# Altium project basketball_robot_main_board_2018.PrjPcb
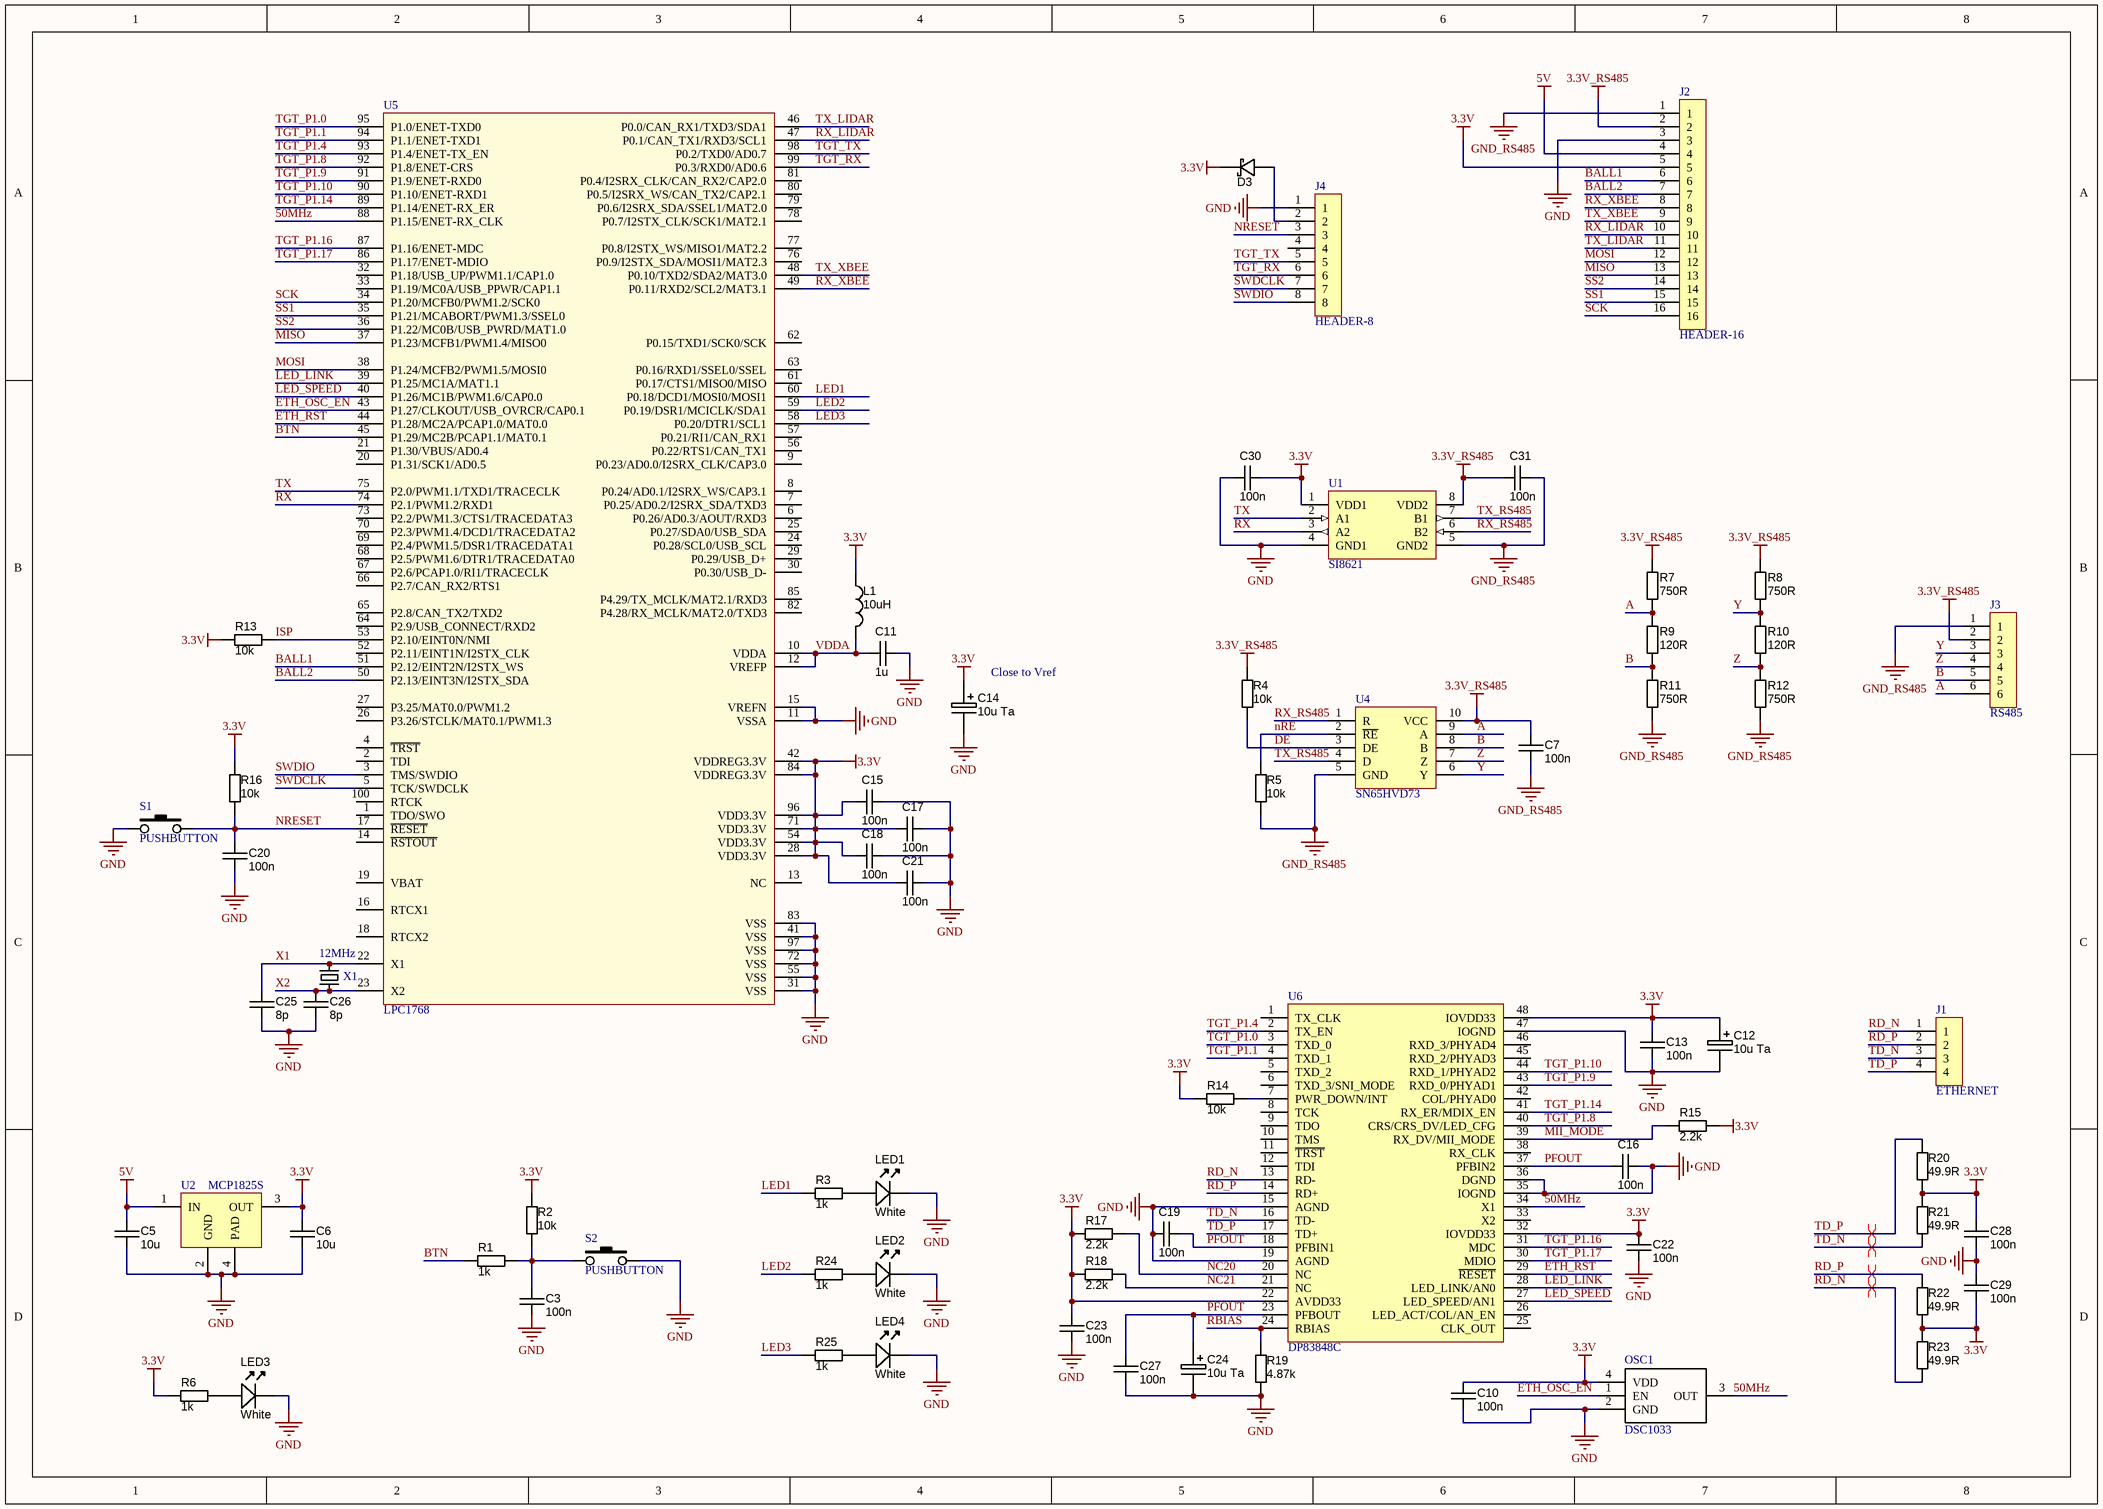
[diagram p0: basketball_robot_main_board_2018.SchDoc]
1 sheet, 70 parts. Net scope: global (net labels, ports and power ports of the same name join across sheets).
Board file: basketball_robot_main_board_2018.PcbDoc

## Sheet basketball_robot_main_board_2018.SchDoc
size A3

### Parts
C3  100n  [CAPC1608X90N]
C5  10u  [CAPC3216X180N]
C6  10u  [CAPC3216X180N]
C7  100n  [CAPC1608X90N]
C10  100n  [CAPC1608X90N]
C11  1u  [CAPC1608X90N]
C12  10u Ta  [CAPMP3528X210N]
C13  100n  [CAPC1608X90N]
C14  10u Ta  [CAPMP3528X210N]
C15  100n  [CAPC1608X90N]
C16  100n  [CAPC1608X90N]
C17  100n  [CAPC1608X90N]
C18  100n  [CAPC1608X90N]
C19  100n  [CAPC1608X90N]
C20  100n  [CAPC1608X90N]
C21  100n  [CAPC1608X90N]
C22  100n  [CAPC1608X90N]
C23  100n  [CAPC1608X90N]
C24  10u Ta  [CAPMP3528X210N]
C25  8p  [CAPC1608X90N]
C26  8p  [CAPC1608X90N]
C27  100n  [CAPC1608X90N]
C28  100n  [CAPC1608X90N]
C29  100n  [CAPC1608X90N]
C30  100n  [CAPC1608X90N]
C31  100n  [CAPC1608X90N]
D3  (no value)  [SOD323]
J1  ETHERNET  [MICRO-MATCH-FOB-04]
J2  HEADER-16  [MICRO-MATCH-FOB-SMD-16]
J3  RS485  [MICRO-MATCH-FOB-06]
J4  HEADER-8  [MICRO-MATCH-FOB-SMD-08]
L1  10uH  [INDC1608N]
LED1  White  [LED-0603-WHITE]
LED2  White  [LED-0603-WHITE]
LED3  White  [LED-0603-WHITE]
LED4  White  [LED-0603-WHITE]
OSC1  DSC1033  [DSC1033-3.2x2.5]
R1  1k  [RESC1608X55N]
R2  10k  [RESC1608X55N]
R3  1k  [RESC1608X55N]
R4  10k  [RESC1608X55N]
R5  10k  [RESC1608X55N]
R6  1k  [RESC1608X55N]
R7  750R  [RESC1608X55N]
R8  750R  [RESC1608X55N]
R9  120R  [RESC1608X55N]
R10  120R  [RESC1608X55N]
R11  750R  [RESC1608X55N]
R12  750R  [RESC1608X55N]
R13  10k  [RESC1608X55N]
R14  10k  [RESC1608X55N]
R15  2.2k  [RESC1608X55N]
R16  10k  [RESC1608X55N]
R17  2.2k  [RESC1608X55N]
R18  2.2k  [RESC1608X55N]
R19  4.87k  [RESC1608X55N]
R20  49.9R  [RESC1608X55N]
R21  49.9R  [RESC1608X55N]
R22  49.9R  [RESC1608X55N]
R23  49.9R  [RESC1608X55N]
R24  1k  [RESC1608X55N]
R25  1k  [RESC1608X55N]
S1  PUSHBUTTON  [KMR421NGLFS]
S2  PUSHBUTTON  [NKK_AB11AP-FA]
U1  SI8621  [SOIC8]
U2  MCP1825S  [SOT230P700X180-4N]
U4  SN65HVD73  [SOP10]
U5  LPC1768  [LQFP100]
U6  DP83848C  [PQFP48]
X1  12MHz  [XTAL-3.2x2.5]

### Nets
3.3V: C6.1 C10.2 C12.1 C13.2 C14.1 C15.1 C17.1 C18.1 C21.1 C22.2 C23.2 C28.2 C29.1 C30.1 D3.K J2.5 L1.1 OSC1.4(VDD) R2.2 R6.2 R13.2 R14.2 R15.1 R16.1 R17.2 R18.2 R20.2 R21.1 R22.2 R23.1 U1.1(VDD1) U2.3(OUT) U5.28(VDD3.3V) U5.42(VDDREG3.3V) U5.54(VDD3.3V) U5.71(VDD3.3V) U5.84(VDDREG3.3V) U5.96(VDD3.3V) U6.22(AVDD33) U6.32(IOVDD33) U6.48(IOVDD33)
3.3V_RS485: C7.1 C31.2 J2.2 J3.2 R4.2 R7.1 R8.1 U1.8(VDD2) U4.10(VCC)
5V: C5.1 J2.4 U2.1(IN)
GND: C3.2 C5.2 C6.2 C10.1 C11.2 C12.2 C13.1 C14.2 C15.2 C16.2 C17.2 C18.2 C19.1 C20.2 C21.2 C22.1 C23.1 C24.2 C25.2 C26.2 C27.1 C28.1 C29.2 C30.2 J2.3 J4.1 LED1.K LED2.K LED3.K LED4.K OSC1.2(GND) R19.2 S1.1 S2.2 U1.4(GND1) U2.2(GND) U2.4(PAD) U5.11(VSSA) U5.15(VREFN) U5.31(VSS) U5.41(VSS) U5.55(VSS) U5.72(VSS) U5.83(VSS) U5.97(VSS) U6.15(AGND) U6.19(AGND) U6.35(IOGND) U6.36(DGND) U6.47(IOGND)
GND_RS485: C7.2 C31.1 J2.1 J3.1 R5.1 R11.2 R12.2 U1.5(GND2) U4.5(GND)
50MHz: OSC1.3(OUT) U5.88(P1.15/ENET-RX_CLK) U6.34(X1)
A: J3.6 R7.2 R9.1 U4.9(A)
B: J3.5 R9.2 R11.1 U4.8(B)
BALL1: J2.6 U5.51(P2.12/EINT2N/I2STX_WS)
BALL2: J2.7 U5.50(P2.13/EINT3N/I2STX_SDA)
BTN: R1.2 U5.45(P1.29/MC2B/PCAP1.1/MAT0.1)
DE: R4.1 U4.3(DE)
ETH_OSC_EN: OSC1.1(EN) U5.43(P1.27/CLKOUT/USB_OVRCR/CAP0.1)
ETH_RST: U5.44(P1.28/MC2A/PCAP1.0/MAT0.0) U6.29(~{RESET})
ISP: R13.1 U5.53(P2.10/EINT0N/NMI)
LED1: R3.2 U5.60(P0.18/DCD1/MOSI0/MOSI1)
LED2: R24.2 U5.59(P0.19/DSR1/MCICLK/SDA1)
LED3: R25.2 U5.58(P0.20/DTR1/SCL1)
LED_LINK: U5.39(P1.25/MC1A/MAT1.1) U6.28(LED_LINK/AN0)
LED_SPEED: U5.40(P1.26/MC1B/PWM1.6/CAP0.0) U6.27(LED_SPEED/AN1)
MII_MODE: R15.2 U6.39(RX_DV/MII_MODE)
MISO: J2.13 U5.37(P1.23/MCFB1/PWM1.4/MISO0)
MOSI: J2.12 U5.38(P1.24/MCFB2/PWM1.5/MOSI0)
NC20: R17.1 U6.20(NC)
NC21: R18.1 U6.21(NC)
nRE: R5.2 U4.2(~{RE})
NRESET: C20.1 J4.3 R16.2 S1.2 U5.17(~{RESET})
PFOUT: C16.1 C19.2 C24.1 C27.2 U6.18(PFBIN1) U6.23(PFBOUT) U6.37(PFBIN2)
RBIAS: R19.1 U6.24(RBIAS)
RD_N: J1.1 R23.2 U6.13(RD-)
RD_P: J1.2 R22.1 U6.14(RD+)
RX: U1.3(A2) U5.74(P2.1/PWM1.2/RXD1)
RX_LIDAR: J2.10 U5.47(P0.1/CAN_TX1/RXD3/SCL1)
RX_RS485: U1.6(B2) U4.1(R)
RX_XBEE: J2.8 U5.49(P0.11/RXD2/SCL2/MAT3.1)
SCK: J2.16 U5.34(P1.20/MCFB0/PWM1.2/SCK0)
SS1: J2.15 U5.35(P1.21/MCABORT/PWM1.3/SSEL0)
SS2: J2.14 U5.36(P1.22/MC0B/USB_PWRD/MAT1.0)
SWDCLK: J4.7 U5.5(TCK/SWDCLK)
SWDIO: J4.8 U5.3(TMS/SWDIO)
TD_N: J1.3 R21.2 U6.16(TD-)
TD_P: J1.4 R20.1 U6.17(TD+)
TGT_P1.0: U5.95(P1.0/ENET-TXD0) U6.3(TXD_0)
TGT_P1.1: U5.94(P1.1/ENET-TXD1) U6.4(TXD_1)
TGT_P1.4: U5.93(P1.4/ENET-TX_EN) U6.2(TX_EN)
TGT_P1.8: U5.92(P1.8/ENET-CRS) U6.40(CRS/CRS_DV/LED_CFG)
TGT_P1.9: U5.91(P1.9/ENET-RXD0) U6.43(RXD_0/PHYAD1)
TGT_P1.10: U5.90(P1.10/ENET-RXD1) U6.44(RXD_1/PHYAD2)
TGT_P1.14: U5.89(P1.14/ENET-RX_ER) U6.41(RX_ER/MDIX_EN)
TGT_P1.16: U5.87(P1.16/ENET-MDC) U6.31(MDC)
TGT_P1.17: U5.86(P1.17/ENET-MDIO) U6.30(MDIO)
TGT_RX: J4.6 U5.99(P0.3/RXD0/AD0.6)
TGT_TX: J4.5 U5.98(P0.2/TXD0/AD0.7)
TX: U1.2(A1) U5.75(P2.0/PWM1.1/TXD1/TRACECLK)
TX_LIDAR: J2.11 U5.46(P0.0/CAN_RX1/TXD3/SDA1)
TX_RS485: U1.7(B1) U4.4(D)
TX_XBEE: J2.9 U5.48(P0.10/TXD2/SDA2/MAT3.0)
VDDA: C11.1 L1.2 U5.10(VDDA) U5.12(VREFP)
X1: C25.1 U5.22(X1) X1.3
X2: C26.1 U5.23(X2) X1.1
Y: J3.3 R8.2 R10.1 U4.6(Y)
Z: J3.4 R10.2 R12.1 U4.7(Z)
NetC3_1: C3.1 R1.1 R2.1 S2.1
NetD3_A: D3.A J4.2
NetLED1_A: LED1.A R3.1
NetLED2_A: LED2.A R24.1
NetLED3_A: LED3.A R6.1
NetLED4_A: LED4.A R25.1
NetR14_1: R14.1 U6.7(PWR_DOWN/INT)

Not connected (* = marked no-connect by the designer): J4 4; U5 1(TDO/SWO) 2(TDI) 4(~{TRST}) 6(P0.26/AD0.3/AOUT/RXD3) 7(P0.25/AD0.2/I2SRX_SDA/TXD3) 8(P0.24/AD0.1/I2SRX_WS/CAP3.1) 9(P0.23/AD0.0/I2SRX_CLK/CAP3.0) 13(NC) 14(~{RSTOUT}) 16(RTCX1) 18(RTCX2) 19(VBAT) 20(P1.31/SCK1/AD0.5) 21(P1.30/VBUS/AD0.4) 24(P0.28/SCL0/USB_SCL) 25(P0.27/SDA0/USB_SDA) 26(P3.26/STCLK/MAT0.1/PWM1.3) 27(P3.25/MAT0.0/PWM1.2) 29(P0.29/USB_D+) 30(P0.30/USB_D-) 32(P1.18/USB_UP/PWM1.1/CAP1.0) 33(P1.19/MC0A/USB_PPWR/CAP1.1) 52(P2.11/EINT1N/I2STX_CLK) 56(P0.22/RTS1/CAN_TX1) 57(P0.21/RI1/CAN_RX1) 61(P0.17/CTS1/MISO0/MISO) 62(P0.15/TXD1/SCK0/SCK) 63(P0.16/RXD1/SSEL0/SSEL) 64(P2.9/USB_CONNECT/RXD2) 65(P2.8/CAN_TX2/TXD2) 66(P2.7/CAN_RX2/RTS1) 67(P2.6/PCAP1.0/RI1/TRACECLK) 68(P2.5/PWM1.6/DTR1/TRACEDATA0) 69(P2.4/PWM1.5/DSR1/TRACEDATA1) 70(P2.3/PWM1.4/DCD1/TRACEDATA2) 73(P2.2/PWM1.3/CTS1/TRACEDATA3) 76(P0.9/I2STX_SDA/MOSI1/MAT2.3) 77(P0.8/I2STX_WS/MISO1/MAT2.2) 78(P0.7/I2STX_CLK/SCK1/MAT2.1) 79(P0.6/I2SRX_SDA/SSEL1/MAT2.0) 80(P0.5/I2SRX_WS/CAN_TX2/CAP2.1) 81(P0.4/I2SRX_CLK/CAN_RX2/CAP2.0) 82(P4.28/RX_MCLK/MAT2.0/TXD3) 85(P4.29/TX_MCLK/MAT2.1/RXD3) 100(RTCK); U6 1(TX_CLK) 5(TXD_2) 6(TXD_3/SNI_MODE) 8(TCK) 9(TDO) 10(TMS) 11(~{TRST}) 12(TDI) 25(CLK_OUT) 26(LED_ACT/COL/AN_EN) 33(X2) 38(RX_CLK) 42(COL/PHYAD0) 45(RXD_2/PHYAD3) 46(RXD_3/PHYAD4)

### Layout directives
differential pair: RD_N, RD_P, TD_N, TD_P

### Notes on the sheet
- (near C14) Close to Vref

### Library data of the parts
C3 C7 C30 C31 = CAPC_100n_0603_X7R_50V_10%: Capacitor SMD Cer 100nF 10% 50V X7R 0603; Manufacturer 1: AVX Corporation; Manufacturer Part Number 1: 06035C104KAT2A; Ratings: 50V; X7R; Material: ceramic; SCDType: spec; Manufacturer 2: TDK Corporation; Manufacturer Part Number 2: C1608X7R1H104K; Package / Case: 0603 (1608 Metric); Tolerance: ±10%; Supplier 1: Digi-Key; Supplier Part Number 1: 478-5052-1-ND; ComponentLink1URL: http://www.avx.com/docs/Catalogs/cx7r.pdf; ComponentLink1Description: http://www.avx.com/docs/Catalogs/cx7r.pdf; Supplier 2: Digi-Key; Supplier Part Number 2: 445-1314-1-ND; ComponentLink2URL: http://product.tdk.com/capacitor/mlcc/en/documents/mlcc_commercial_general_en.pdf; ComponentLink2Description: http://product.tdk.com/capacitor/mlcc/en/documents/mlcc_commercial_general_en.pdf; Value: 100n
C5 C6 = CAPC_10u_1206_10V: Capacitor SMD Cer 10uF 10% 10V X5R 1206; Manufacturer 1: KEMET; Manufacturer Part Number 1: C1206C106K8PACTU; Ratings: 10V; X5R; Material: ceramic; Value: 10µ; SCDType: undef; Package / Case: 1206 (3216 metric); Tolerance: ±10%; Supplier 1: Digi-Key; Supplier Part Number 1: C1206C106K8PACTU-ND
C10 C13 C15-C23 C25-C29 = CAPC_18p_0603_100V: Capacitor SMD Cer 18pF 2% 100V NP0 0603; Manufacturer 1: AVX Corporation; Manufacturer Part Number 1: 06031A180GAT2A; Ratings: 100V; NP0; Value: 18p; SCDType: spec; Tolerance: ±2%; Operating Temperature: -55°C ~ 125°C; Package / Case: 0603 (1608 Metric); Supplier 1: Digi-Key; Supplier Part Number 1: 478-6025-1-ND; Size / Dimension: 0.063" L x 0.032" W (1.60mm x 0.81mm); Thickness (Max): 0.035" (0.90mm); ComponentLink1URL: http://www.avx.com/docs/Catalogs/ccog.pdf; ComponentLink1Description: http://www.avx.com/docs/Catalogs/ccog.pdf
C11 = CAPC_1u_0603_X7R_16V_10%: Capacitor SMD Cer 1uF 10% 16V X7R 0603; Manufacturer 1: TDK Corporation; Manufacturer Part Number 1: C1608X7R1C105K; Ratings: 16V; X7R; Material: ceramic; SCDType: spec; Value: 1µ; Package / Case: 0603 (1608 metric); Tolerance: ±10%; Supplier 1: Digi-Key; Supplier Part Number 1: 445-1604-1-ND; ComponentLink1URL: http://product.tdk.com/capacitor/mlcc/en/documents/mlcc_commercial_general_en.pdf; ComponentLink1Description: http://product.tdk.com/capacitor/mlcc/en/documents/mlcc_commercial_general_en.pdf
C12 C14 C24 = CAPT_47u_1210_6V3: Capacitor SMD Tantalum 47uF 20% 6.3V 1210; Manufacturer 1: AVX Corporation; Manufacturer Part Number 1: TCJB476M006R0070; Manufacturer Size Code: B; Voltage - Rated: 6V3; ESR (Equivalent Series Resistance): 70.0 mOhm; Type: Molded; Value: 47µ; SCDType: spec; Package / Case: 1210 (3528 Metric); Tolerance: ±20%; Material: Tantalum; Supplier 1: Digi-Key; Supplier Part Number 1: 478-3139-1-ND; Operating Temperature: -55°C ~ 125°C; Size / Dimension: 0.138" L x 0.110" W (3.50mm x 2.80mm); Height - Seated (Max): 0.083" (2.10mm); ComponentLink1URL: http://www.avx.com/docs/Catalogs/tcj.pdf; ComponentLink1Description: http://www.avx.com/docs/Catalogs/tcj.pdf; Ratings: 6.3V
D3 = DIODE_SCHOTTKY_SS0520: Diode Schottky SMD 20V 0.5A SOD123; Manufacturer 1: Fairchild Semiconductor; Manufacturer Part Number 1: MBR0520L; Material: Si; Ratings: 20V; 0.5A; SCDType: source; Manufacturer 4: DC Components Co; Package / Case: SOD-123; Supplier 1: Digi-Key; Supplier Part Number 1: MBR0520LCT-ND; Supplier 2: Digi-Key; Supplier Part Number 2: MBR0520LT1GOSCT-ND; Manufacturer 2: ON Semiconductor; Manufacturer Part Number 2: MBR0520LT1G; ComponentLink1URL: http://www.fairchildsemi.com/ds/MB/MBR0520L.pdf; ComponentLink1Description: http://www.fairchildsemi.com/ds/MB/MBR0520L.pdf; ComponentLink2URL: http://www.onsemi.com/pub_link/Collateral/MBR0520LT1-D.PDF; ComponentLink2Description: http://www.onsemi.com/pub_link/Collateral/MBR0520LT1-D.PDF; Supplier 3: Digi-Key; Supplier Part Number 3: B0520LW-FDICT-ND; ComponentLink3URL: http://www.diodes.com/datasheets/ds30051.pdf; ComponentLink3Description: http://www.diodes.com/datasheets/ds30051.pdf; Manufacturer 3: Diodes Inc; Manufacturer Part Number 3: B0520LW-7-F; Manufacturer Part Number 4: SS0520
J1 = HEADER-4
J3 = HEADER-6
L1 = FERRITE_120R-100MHz_0603: Ferrite bead 120 Ohm at 100 MHz 2A 0603 SMD; Manufacturer 1: Murata Electronics North America; Manufacturer Part Number 1: BLM18PG121SN1D; Current: 900mA; DC Resistance (DCR): 172.9 mOhm Max; Frequency - Self Resonant: 23MHz; Frequency - Test: 100kHz; Impedance @ Frequency: 120 Ohm @ 100MHz; Filter Type: Differential Mode - Single; Number of Lines: 1; Ratings: 2 A; 50 mO DC; Value: 120R @ 100 MHz; SCDType: source; Current - Saturation: 900mA; Current - Temperature Rise: 900mA; Applications: Power Supplies; Package / Case: 1210 (3225 Metric); Operating Temperature: -40°C ~ 105°C; ComponentLink1URL: http://www.yuden.co.jp/ut/product/pdf/wound02_e.pdf; ComponentLink1Description: http://www.yuden.co.jp/ut/product/pdf/wound02_e.pdf; Supplier 1: Digi-Key; Supplier Part Number 1: 490-1037-1-ND; Current Rating: 2A; Mounting Type: Surface Mount; Height (Max): 0.037" (0.95mm); Size / Dimension: 0.063" L x 0.031" W (1.60mm x 0.80mm); ComponentLink2URL: http://search.murata.co.jp/Ceramy/image/img/PDF/ENG/L0110S0100BLM18P.pdf; ComponentLink2Description: http://search.murata.co.jp/Ceramy/image/img/PDF/ENG/L0110S0100BLM18P.pdf
LED1-LED4 = LED_SMD_White_0603_Bright: LED 0603 SMD Bright White 8700K; Manufacturer 1: Lite-On Inc; Manufacturer Part Number 1: LTW-C193TS5; Material: InGaN; Ratings: Ultra Bright; 8700K; Millicandela Rating: 230mcd; Voltage - Forward (Vf) Typ: 3.3V; Viewing Angle: 120°; Lens Type: Clear, Tinted; Lens Style/Size: Rectangle with Flat Top, 0.8mm x 1.1mm; Voltage - Forward (Vf) @ 10mA: 3.0V; SCDType: source; Package / Case: 0603 (1608 metric); Supplier 1: Digi-Key; Supplier Part Number 1: 160-1721-1-ND; Supplier 2: Digi-Key; Supplier Part Number 2: APT1608QWF/D-ND; Manufacturer 2: Kingbright Corp; Manufacturer Part Number 2: APT1608QWF/D; Color: White; Size / Dimension: 1.60mm L x 0.80mm W; Mounting Type: Surface Mount; Luminous Flux @ Current - Test: -; ComponentLink2URL: http://www.kingbrightusa.com/images/catalog/SPEC/APT1608QWF-D.pdf; ComponentLink2Description: http://www.kingbrightusa.com/images/catalog/SPEC/APT1608QWF-D.pdf; ComponentLink1URL: http://media.digikey.com/pdf/Data%20Sheets/Lite-On%20PDFs/LTW-C193TS5.pdf; ComponentLink1Description: http://media.digikey.com/pdf/Data%20Sheets/Lite-On%20PDFs/LTW-C193TS5.pdf
R1-R8 R11 R12 R24 R25 = RES_120R_0603_5%: Resistor SMD chip 120 Ohm 0.1W 5% 0603; Manufacturer 1: Vishay Dale; Manufacturer Part Number 1: CRCW0603120RJNEA; Ratings: 1/10 W; SCDType: spec; Value: 120R; Package / Case: 0603 (1608 metric); Tolerance: ±5%; Material: Thick Film; Supplier 1: Digi-Key; Supplier Part Number 1: 541-120GCT-ND; ComponentLink1URL: http://www.vishay.com/doc?20035; ComponentLink1Description: http://www.vishay.com/doc?20035; Supplier 2: Digi-Key; Supplier Part Number 2: 311-120GRCT-ND; Manufacturer 2: Yageo; Manufacturer Part Number 2: RC0603JR-07120RL; ComponentLink2URL: http://www.yageo.com/documents/recent/PYu-RC0603_51_RoHS_L_4.pdf; ComponentLink2Description: http://www.yageo.com/documents/recent/PYu-RC0603_51_RoHS_L_4.pdf
R9 R10 = RES_120R_0603_5%: Resistor SMD chip 120 Ohm 0.1W 5% 0603; Manufacturer 1: Vishay Dale; Manufacturer Part Number 1: CRCW0603120RJNEA; Ratings: 1/10 W; SCDType: spec; Package / Case: 0603 (1608 metric); Tolerance: ±5%; Material: Thick Film; Supplier 1: Digi-Key; Supplier Part Number 1: 541-120GCT-ND; ComponentLink1URL: http://www.vishay.com/doc?20035; ComponentLink1Description: http://www.vishay.com/doc?20035; Supplier 2: Digi-Key; Supplier Part Number 2: 311-120GRCT-ND; Manufacturer 2: Yageo; Manufacturer Part Number 2: RC0603JR-07120RL; ComponentLink2URL: http://www.yageo.com/documents/recent/PYu-RC0603_51_RoHS_L_4.pdf; ComponentLink2Description: http://www.yageo.com/documents/recent/PYu-RC0603_51_RoHS_L_4.pdf; Value: 120R
R13-R23 = RES_10K_0603_5%: Resistor SMD chip 10k Ohm 0.1W 5% 0603; Manufacturer 1: Yageo; Manufacturer Part Number 1: RC0603JR-0710KL; Ratings: 1/10 W; SCDType: spec; Package / Case: 0603 (1608 metric); Tolerance: ±5%; Material: Thick Film; Supplier 1: Digi-Key; Supplier Part Number 1: 311-10KGRCT-ND; Supplier 2: Digi-Key; Supplier Part Number 2: 541-10KGCT-ND; Manufacturer 2: Vishay Dale; Manufacturer Part Number 2: CRCW060310K0JNEA; ComponentLink2URL: http://www.vishay.com/doc?20035; ComponentLink2Description: http://www.vishay.com/doc?20035; ComponentLink1URL: http://www.yageo.com/documents/recent/PYu-RC0603_51_RoHS_L_4.pdf; ComponentLink1Description: http://www.yageo.com/documents/recent/PYu-RC0603_51_RoHS_L_4.pdf; Value: 10K
U2 = MIC5239
U4 = SN65HVD3086E
X1 = XTAL-3.2X2.5